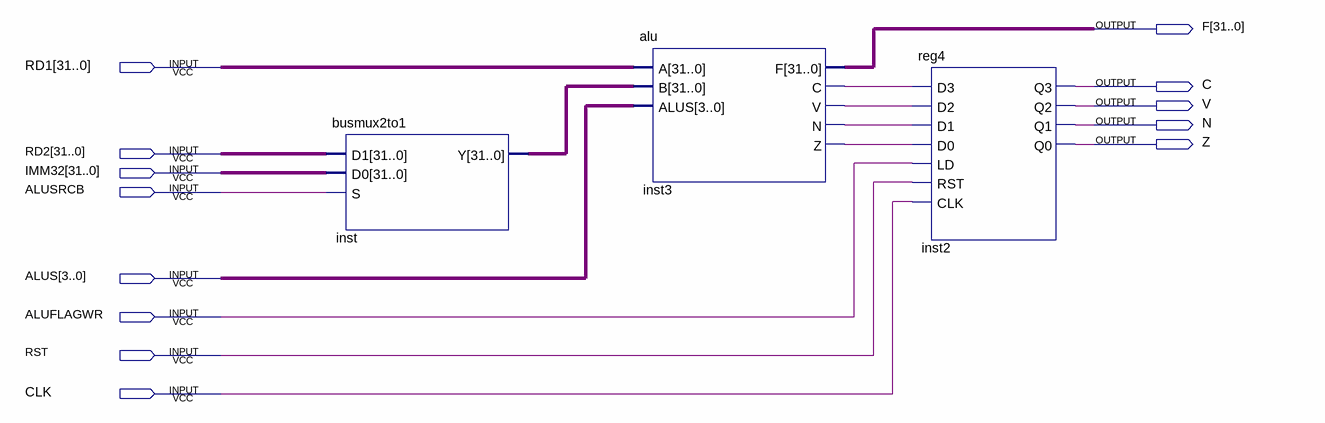
[diagram p0: schematic sheet]
// Quartus schematic execute.bdf as structural Verilog: 3 symbols, 13 pins
module execute (
  input  [31:0] RD1,
  input  [31:0] RD2,
  input  [31:0] IMM32,
  input  ALUSRCB,
  input  [3:0] ALUS,
  input  ALUFLAGWR,
  input  RST,
  input  CLK,
  output [31:0] F,
  output C,
  output V,
  output N,
  output Z
);

  wire inst3_c, inst3_n, inst3_v, inst3_z;
  wire [31:0] inst_y;

  busmux2to1 inst (.D1(RD2), .D0(IMM32), .S(ALUSRCB), .Y(inst_y));
  alu inst3 (.A(RD1), .B(inst_y), .ALUS(ALUS), .C(inst3_c), .V(inst3_v), .N(inst3_n), .Z(inst3_z), .F(F));
  reg4 inst2 (
    .D3(inst3_c), .D2(inst3_v), .D1(inst3_n), .D0(inst3_z), .LD(ALUFLAGWR), .RST(RST), .CLK(CLK), .Q3(C),
    .Q2(V), .Q1(N), .Q0(Z));
endmodule
